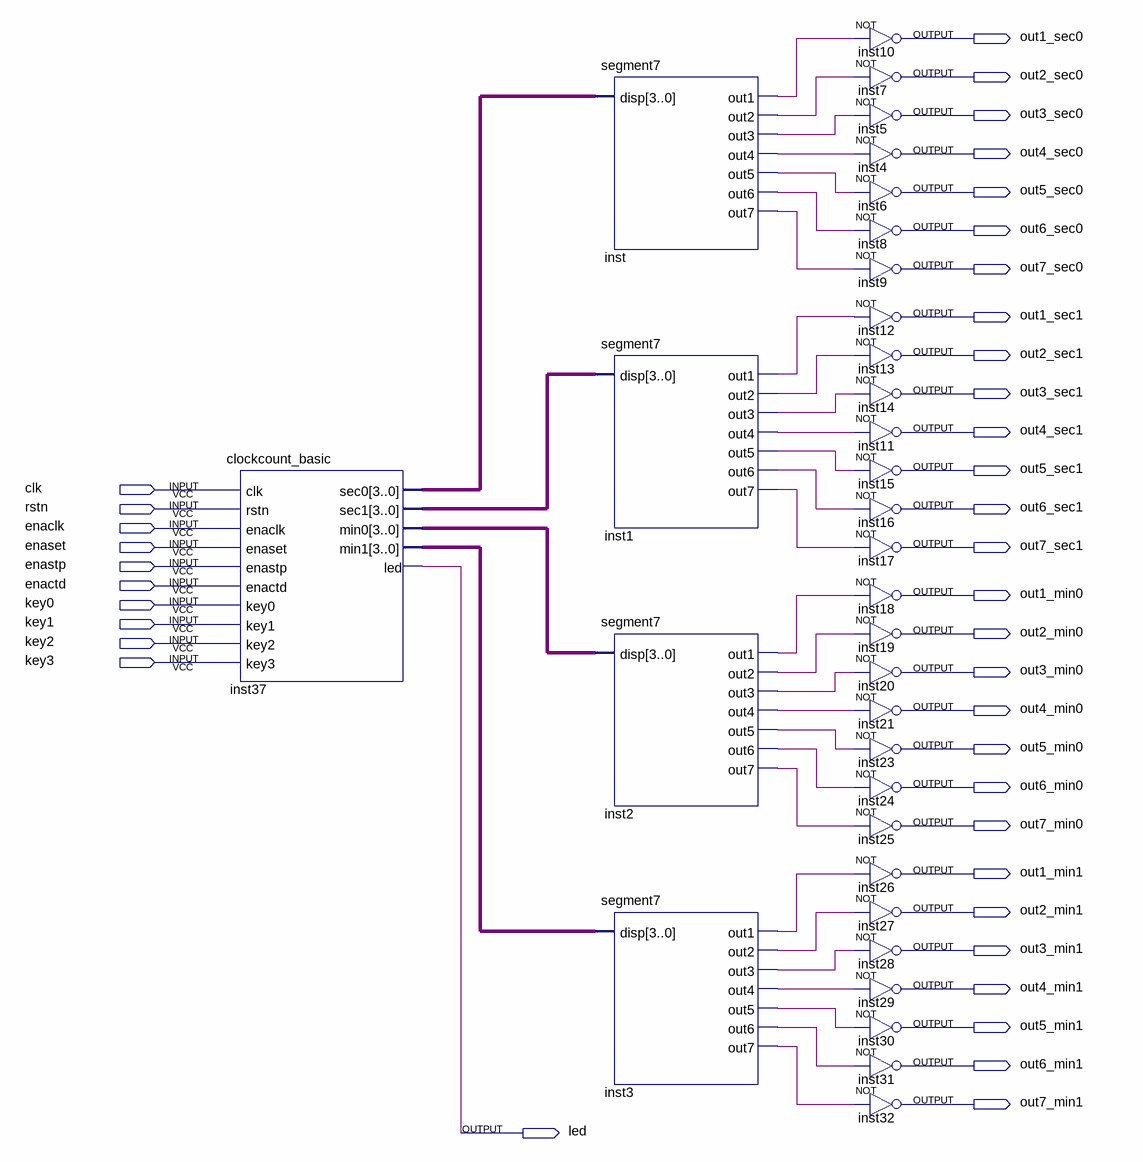
[diagram p0: schematic sheet]
// Quartus schematic DigitalClock.bdf as structural Verilog: 33 symbols, 39 pins
module DigitalClock (
  input  clk,
  input  rstn,
  input  enaclk,
  input  enaset,
  input  enastp,
  input  enactd,
  input  key0,
  input  key1,
  input  key2,
  input  key3,
  output out1_sec0,
  output out2_sec0,
  output out3_sec0,
  output out4_sec0,
  output out5_sec0,
  output out6_sec0,
  output out7_sec0,
  output out1_sec1,
  output out2_sec1,
  output out3_sec1,
  output out4_sec1,
  output out5_sec1,
  output out6_sec1,
  output out7_sec1,
  output out1_min0,
  output out2_min0,
  output out3_min0,
  output out4_min0,
  output out5_min0,
  output out6_min0,
  output out7_min0,
  output out1_min1,
  output out2_min1,
  output out3_min1,
  output out4_min1,
  output out5_min1,
  output out6_min1,
  output out7_min1,
  output led
);

  wire inst1_out1, inst1_out2, inst1_out3, inst1_out4, inst1_out5, inst1_out6, inst1_out7, inst2_out1,
       inst2_out2, inst2_out3, inst2_out4, inst2_out5, inst2_out6, inst2_out7, inst3_out1, inst3_out2,
       inst3_out3, inst3_out4, inst3_out5, inst3_out6, inst3_out7, inst_out1, inst_out2, inst_out3,
       inst_out4, inst_out5, inst_out6, inst_out7;
  wire [3:0] inst37_min0, inst37_min1, inst37_sec0, inst37_sec1;

  clockcount_basic inst37 (
    .clk(clk), .rstn(rstn), .enaclk(enaclk), .enaset(enaset), .enastp(enastp), .enactd(enactd), .key0(key0),
    .key1(key1), .key2(key2), .key3(key3), .sec0(inst37_sec0), .sec1(inst37_sec1), .min0(inst37_min0),
    .min1(inst37_min1), .led(led));
  segment7 inst (
    .disp(inst37_sec0), .out1(inst_out1), .out2(inst_out2), .out3(inst_out3), .out4(inst_out4),
    .out5(inst_out5), .out6(inst_out6), .out7(inst_out7));
  segment7 inst1 (
    .disp(inst37_sec1), .out1(inst1_out1), .out2(inst1_out2), .out3(inst1_out3), .out4(inst1_out4),
    .out5(inst1_out5), .out6(inst1_out6), .out7(inst1_out7));
  segment7 inst2 (
    .disp(inst37_min0), .out1(inst2_out1), .out2(inst2_out2), .out3(inst2_out3), .out4(inst2_out4),
    .out5(inst2_out5), .out6(inst2_out6), .out7(inst2_out7));
  segment7 inst3 (
    .disp(inst37_min1), .out1(inst3_out1), .out2(inst3_out2), .out3(inst3_out3), .out4(inst3_out4),
    .out5(inst3_out5), .out6(inst3_out6), .out7(inst3_out7));
  not inst10 (out1_sec0, inst_out1);
  not inst7 (out2_sec0, inst_out2);
  not inst5 (out3_sec0, inst_out3);
  not inst4 (out4_sec0, inst_out4);
  not inst6 (out5_sec0, inst_out5);
  not inst8 (out6_sec0, inst_out6);
  not inst9 (out7_sec0, inst_out7);
  not inst12 (out1_sec1, inst1_out1);
  not inst13 (out2_sec1, inst1_out2);
  not inst14 (out3_sec1, inst1_out3);
  not inst11 (out4_sec1, inst1_out4);
  not inst15 (out5_sec1, inst1_out5);
  not inst16 (out6_sec1, inst1_out6);
  not inst17 (out7_sec1, inst1_out7);
  not inst18 (out1_min0, inst2_out1);
  not inst19 (out2_min0, inst2_out2);
  not inst20 (out3_min0, inst2_out3);
  not inst21 (out4_min0, inst2_out4);
  not inst23 (out5_min0, inst2_out5);
  not inst24 (out6_min0, inst2_out6);
  not inst25 (out7_min0, inst2_out7);
  not inst26 (out1_min1, inst3_out1);
  not inst27 (out2_min1, inst3_out2);
  not inst28 (out3_min1, inst3_out3);
  not inst29 (out4_min1, inst3_out4);
  not inst30 (out5_min1, inst3_out5);
  not inst31 (out6_min1, inst3_out6);
  not inst32 (out7_min1, inst3_out7);
endmodule
